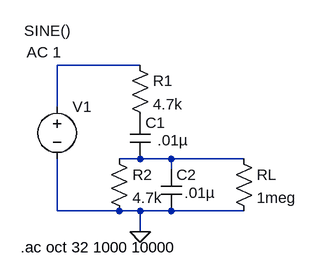
[diagram p0: schematic wien-network.asc]
wien-network.asc, the LTspice schematic file:
Version 4
SHEET 1 880 680
WIRE 176 16 48 16
WIRE 48 80 48 16
WIRE 176 160 144 160
WIRE 224 160 176 160
WIRE 336 160 224 160
WIRE 224 176 224 160
WIRE 48 240 48 160
WIRE 144 240 48 240
WIRE 176 240 144 240
WIRE 224 240 176 240
WIRE 336 240 224 240
WIRE 176 272 176 240
FLAG 176 272 0
SYMBOL res 128 144 R0
SYMATTR InstName R2
SYMATTR Value 4.7k
SYMBOL res 160 0 R0
SYMATTR InstName R1
SYMATTR Value 4.7k
SYMBOL cap 160 96 R0
WINDOW 3 43 35 Left 2
SYMATTR Value .01µ
SYMATTR InstName C1
SYMBOL cap 208 176 R0
WINDOW 3 36 36 Left 2
SYMATTR Value .01µ
SYMATTR InstName C2
SYMBOL res 320 144 R0
SYMATTR InstName RL
SYMATTR Value 1meg
SYMBOL voltage 48 64 R0
WINDOW 3 -51 -101 Left 2
WINDOW 123 -47 -68 Left 2
WINDOW 39 0 0 Left 2
SYMATTR Value SINE()
SYMATTR Value2 AC 1
SYMATTR InstName V1
TEXT -8 296 Left 2 !.ac oct 32 1000 10000

The netlist it stands for:
* wien-network.asc
R2 N002 0 4.7k
R1 N001 P001 4.7k
C1 P001 N002 .01µ
C2 N002 0 .01µ
RL N002 0 1meg
V1 N001 0 SINE() AC 1
.ac oct 32 1000 10000
.backanno
.end